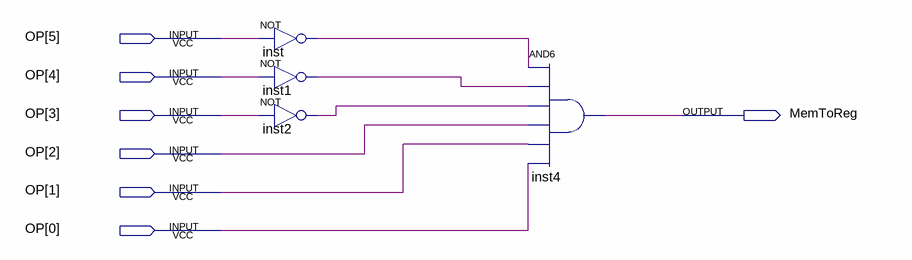
[diagram p0: schematic sheet]
// Quartus schematic MemToReg.bdf as structural Verilog: 4 symbols, 7 pins
module MemToReg (
  input  [5:0] OP,
  output MemToReg
);

  wire inst1_out, inst2_out, inst_out;

  not inst (inst_out, OP[5]);
  not inst1 (inst1_out, OP[4]);
  not inst2 (inst2_out, OP[3]);
  and inst4 (MemToReg, inst_out, inst1_out, inst2_out, OP[2], OP[1], OP[0]);
endmodule
